# EAGLE schematic hologramassettrackker_HCV1ofzQy6 (EAGLE 7.7.0)
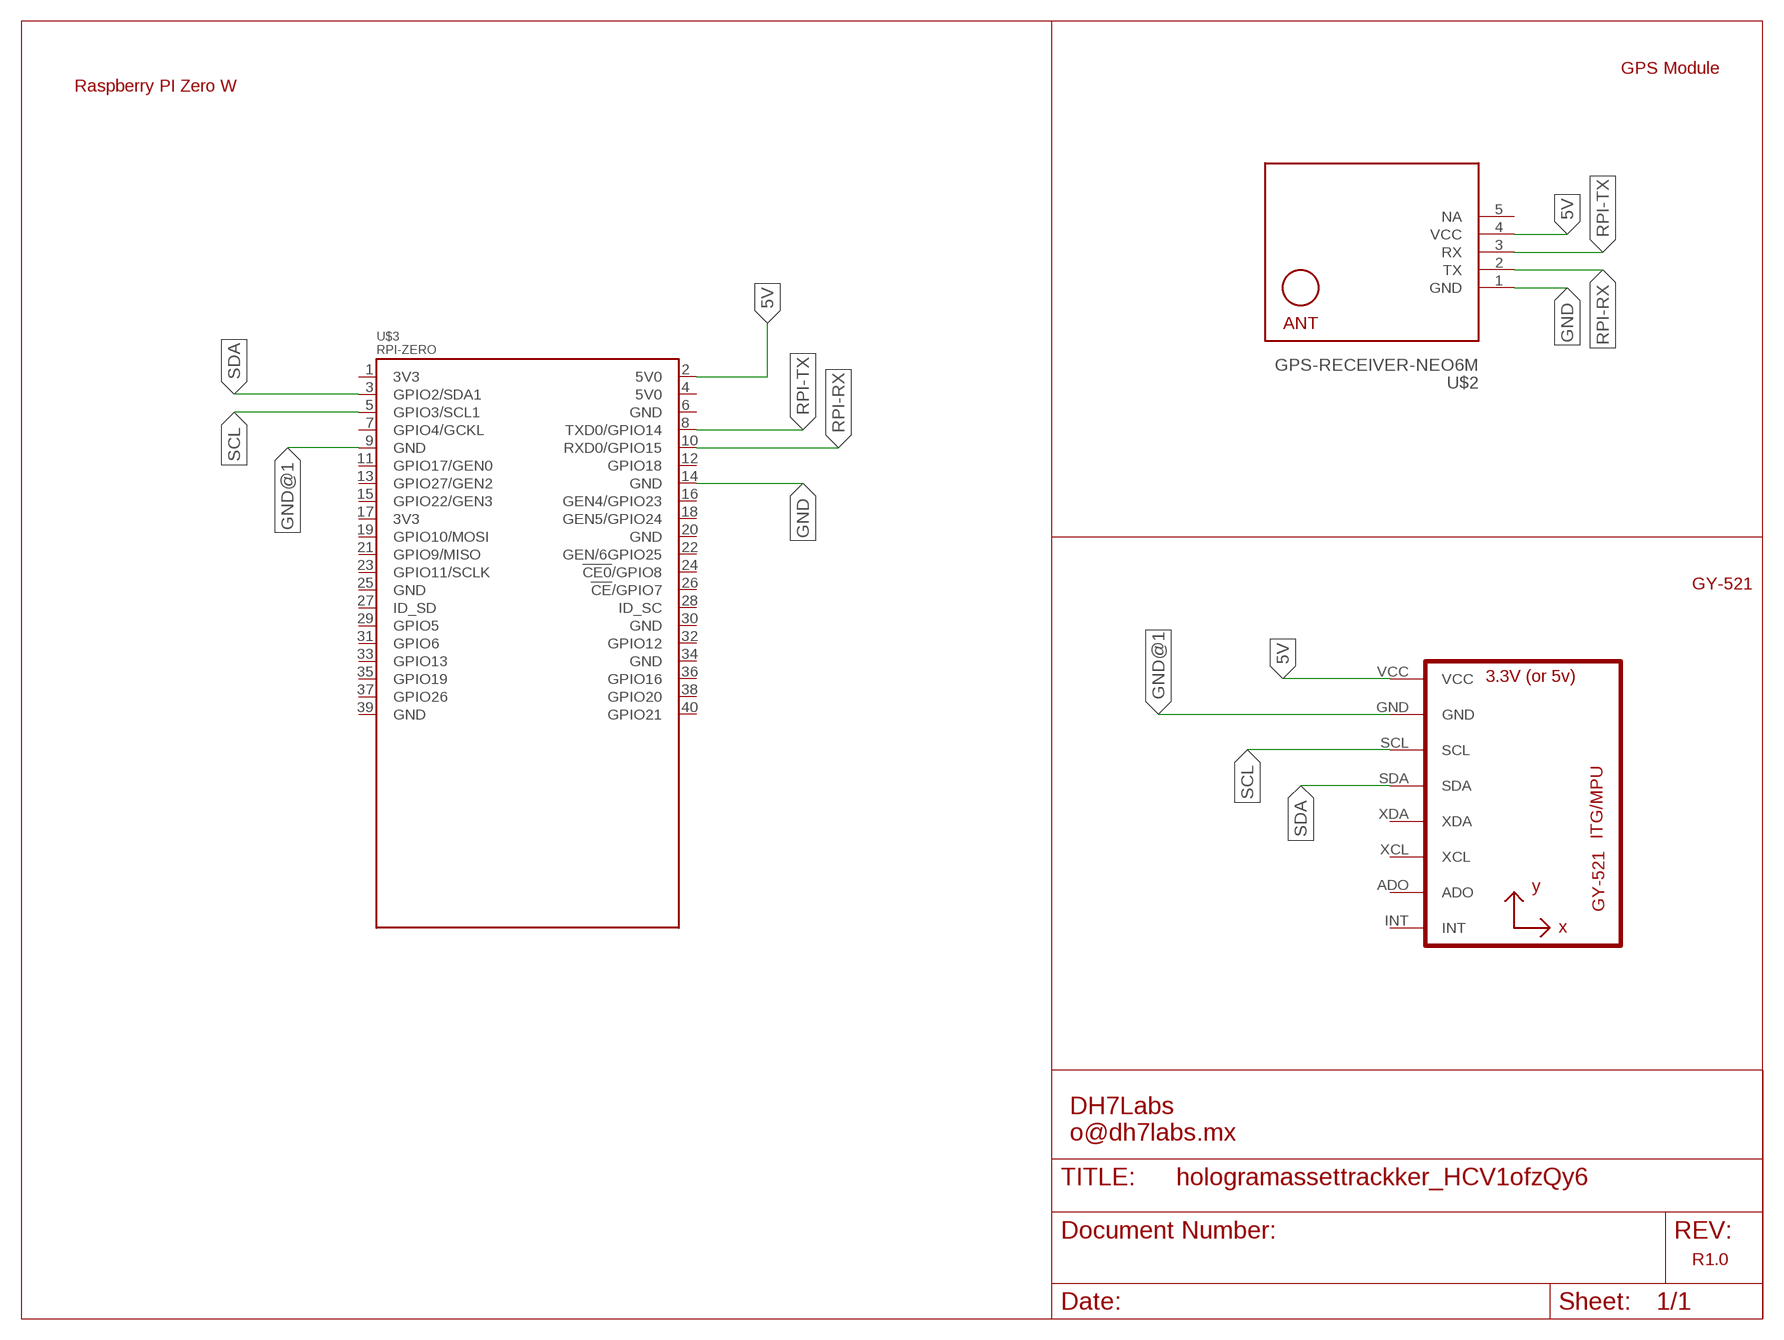
[diagram p0: schematic, sheet 1]

## Parts
U1  GY-521MPU6050  [GY-521]
U$2  GPS-RECEIVER-NEO6M  [GPS-RECEIVER-NEO6M]
U$3  RPI-ZERO  [RASP_PI_ZERO_BOARD_FULL]

## Nets
5V: U1.VCC U$2.4(VCC) U$3.2(5V0)
GND: U$2.1(GND) U$3.14(GND)
GND@1: U1.GND U$3.9(GND)
RPI-RX: U$2.2(TX) U$3.10(RXD0/GPIO15)
RPI-TX: U$2.3(RX) U$3.8(TXD0/GPIO14)
SCL: U1.SCL U$3.5(GPIO3/SCL1)
SDA: U1.SDA U$3.3(GPIO2/SDA1)
Unconnected: U1.ADO U1.INT U1.XCL U1.XDA U$2.5(NA) U$3.1(3V3) U$3.4(5V0) U$3.6(GND) U$3.7(GPIO4/GCKL) U$3.11(GPIO17/GEN0) U$3.12(GPIO18) U$3.13(GPIO27/GEN2) U$3.15(GPIO22/GEN3) U$3.16(GEN4/GPIO23) U$3.17(3V3) U$3.18(GEN5/GPIO24) U$3.19(GPIO10/MOSI) U$3.20(GND) U$3.21(GPIO9/MISO) U$3.22(GEN/6GPIO25) U$3.23(GPIO11/SCLK) U$3.24(!CE0!/GPIO8) U$3.25(GND) U$3.26(!CE!/GPIO7) U$3.27(ID_SD) U$3.28(ID_SC) U$3.29(GPIO5) U$3.30(GND) U$3.31(GPIO6) U$3.32(GPIO12) U$3.33(GPIO13) U$3.34(GND) U$3.35(GPIO19) U$3.36(GPIO16) U$3.37(GPIO26) U$3.38(GPIO20) U$3.39(GND) U$3.40(GPIO21)

## Notes on the sheet
- GPS Module
- Raspberry PI Zero W
- GY-521
- DH7Labs
  o@dh7labs.mx
- R1.0

## Library data of the parts
U1 = gy-521:GY-521
U$2 = diy-modules:GPS-RECEIVER-NEO6M: GPS Receiver Module based on NEO-6 device Short tutorial how to use NEO-6 module with Arduino: http://www.xarg.org/2016/06/neo6mv2-gps-module-with-arduino/ NEO-6 datasheet is available here: https://www.u-blox.com/sites/default/files/products/documents/NEO-6_DataSheet_%28GPS.G6-HW-09005%29.pdf Click here to find device on ebay.com <http://www.ebay.com/sch/gyneo6mv2>
U$3 = rpi-zero:RPI-ZERO